# Altium schematic sheet 3V3_PCM.SchDoc
size A4
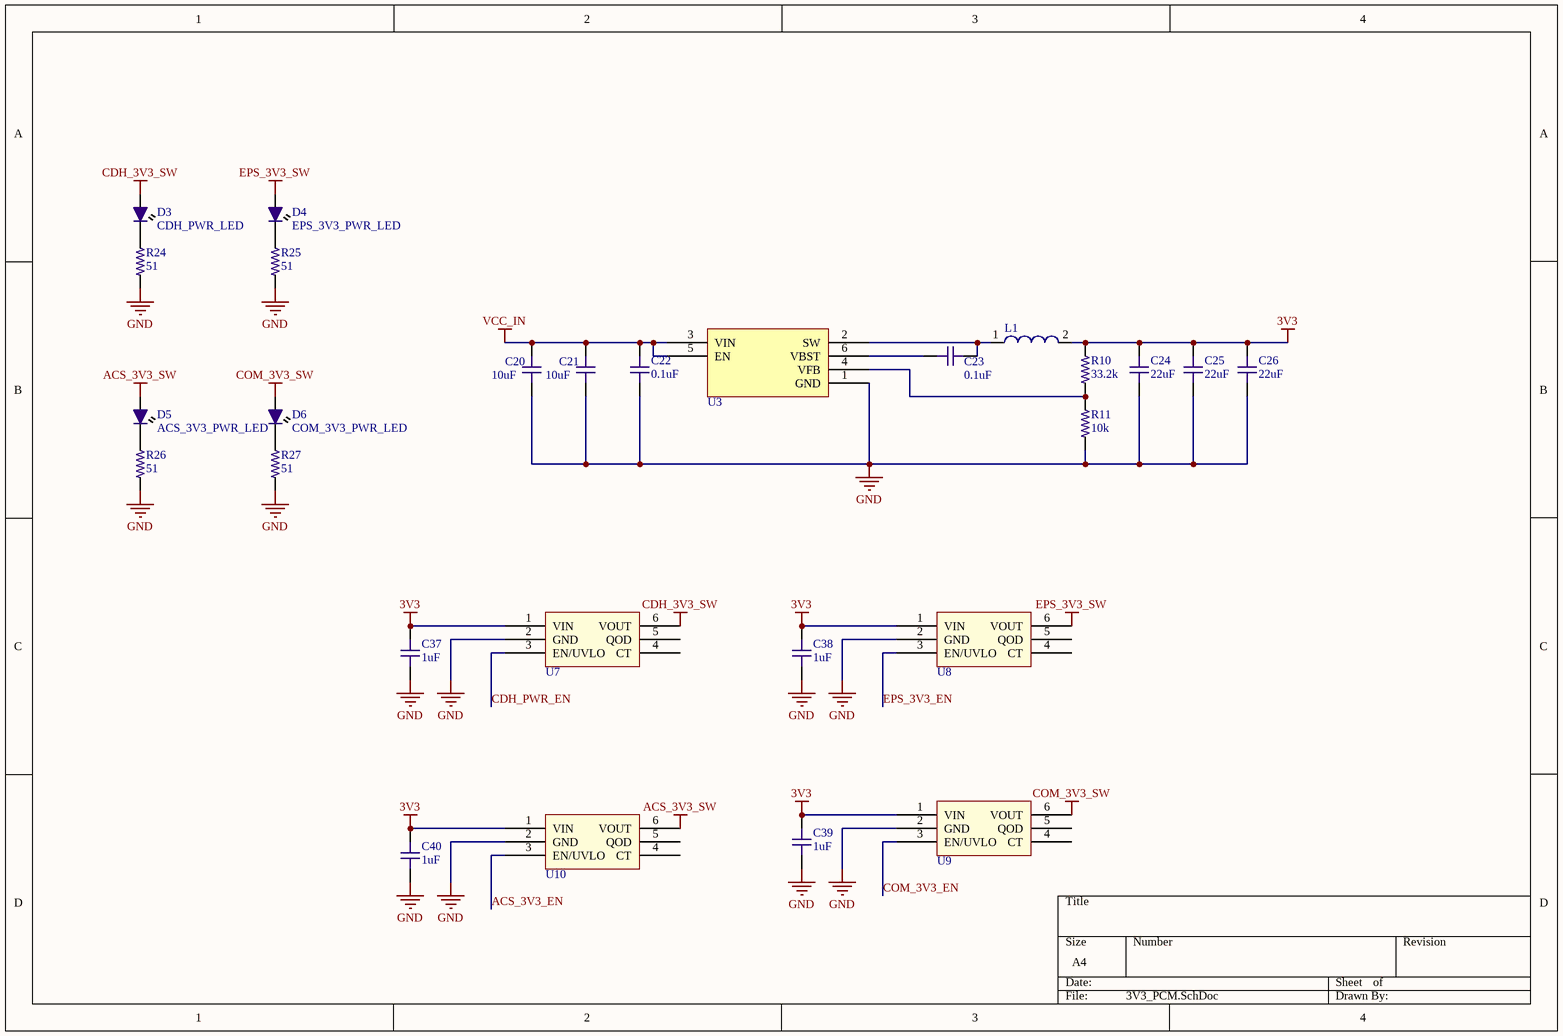
[diagram p0: 3V3_PCM.SchDoc]

## Parts
C20  value 10uF  [C1206-IPC]  (hidden comment: Cin)
C21  value 10uF  [C1206-IPC]  (hidden comment: Cin)
C22  value 0.1uF  [C0603-IPC]  (hidden comment: Cinx)
C23  value 0.1uF  [C0603-IPC]  (hidden comment: Cbst)
C24  value 22uF  [C0603-IPC]  (hidden comment: Cout)
C25  value 22uF  [C0603-IPC]  (hidden comment: Cout)
C26  value 22uF  [C0603-IPC]  (hidden comment: Cout)
C37  value 1uF  [C0603-IPC]  (hidden comment: Capacitor)
C38  value 1uF  [C0603-IPC]  (hidden comment: Capacitor)
C39  value 1uF  [C0603-IPC]  (hidden comment: Capacitor)
C40  value 1uF  [C0603-IPC]  (hidden comment: Capacitor)
D3  CDH_PWR_LED  [LED0603-IPC]
D4  EPS_3V3_PWR_LED  [LED0603-IPC]
D5  ACS_3V3_PWR_LED  [LED0603-IPC]
D6  COM_3V3_PWR_LED  [LED0603-IPC]
L1  74437349022  [WE-LHMI 7050]  (value not drawn)
R10  value 33.2k  [R0402-IPC]  (hidden comment: Rfbt)
R11  value 10k  [R0402-IPC]  (hidden comment: Rfbb)
R24  value 51  [R0603-IPC]  (hidden comment: 0603 Template)
R25  value 51  [R0603-IPC]  (hidden comment: 0603 Template)
R26  value 51  [R0603-IPC]  (hidden comment: 0603 Template)
R27  value 51  [R0603-IPC]  (hidden comment: 0603 Template)
U3  Buck  [SOT23-6_L]  (value not drawn)
U7  One Channel Load Switch  [TPS22810-Q1]  (value not drawn)
U8  One Channel Load Switch  [TPS22810-Q1]  (value not drawn)
U9  One Channel Load Switch  [TPS22810-Q1]  (value not drawn)
U10  One Channel Load Switch  [TPS22810-Q1]  (value not drawn)

## Nets
3V3: C24.2 C25.2 C26.2 C37.2 C38.2 C39.2 C40.2 L1.2 R10.2 U7.1(VIN) U8.1(VIN) U9.1(VIN) U10.1(VIN)
ACS_3V3_SW: D5.A U10.6(VOUT)
CDH_3V3_SW: D3.A U7.6(VOUT)
COM_3V3_SW: D6.A U9.6(VOUT)
EPS_3V3_SW: D4.A U8.6(VOUT)
GND: C20.1 C21.1 C22.1 C24.1 C25.1 C26.1 C37.1 C38.1 C39.1 C40.1 R11.1 R24.2 R25.2 R26.2 R27.2 U3.1(GND) U7.2(GND) U8.2(GND) U9.2(GND) U10.2(GND)
VCC_IN: C20.2 C21.2 C22.2 U3.3(VIN) U3.5(EN)
ACS_3V3_EN: U10.3(EN/UVLO)
CDH_PWR_EN: U7.3(EN/UVLO)
COM_3V3_EN: U9.3(EN/UVLO)
EPS_3V3_EN: U8.3(EN/UVLO)
NetC23_1: C23.1 U3.6(VBST)
NetC23_2: C23.2 L1.1 U3.2(SW)
NetD3_K: D3.K R24.1
NetD4_K: D4.K R25.1
NetD5_K: D5.K R26.1
NetD6_K: D6.K R27.1
NetR10_1: R10.1 R11.2 U3.4(VFB)

Not connected (* = marked no-connect by the designer): U7 4(CT) 5(QOD); U8 4(CT) 5(QOD); U9 4(CT) 5(QOD); U10 4(CT) 5(QOD)

## Library data of the parts
C20 C21 = 15: Capacitor (1206) 10uF 25V X5R 1206; OrbitPartId: 15; Type: Passive; EIA Code: X5R; Max. Voltage: 25V; PartId: 1; Subtype: Capacitor; ComponentLink1Description: 12063D106KAT2A; ComponentLink1URL: https://www.digikey.ca/en/products/detail/avx-corporation/12063D106KAT2A/1950914
C22 C23 = 13: Cap Cer 0.1uF 10% 25V Cer Cap X7R 0603; OrbitPartId: 13; Type: Passive; EIA Code: X7R; Max. Voltage: 25V; PartId: 1; Subtype: Capacitor; ComponentLink1Description: C0603C104K3RACTU; ComponentLink1URL: https://www.digikey.ca/en/products/detail/kemet/C0603C104K3RACTU/416044?s=N4IgTCBcDaIMIAYBsCDMcCMCAsBpVASgIJwAqAqiALoC%2BQA
C24-C26 = 13: Cap Cer 22uF 10V X5R 0603; OrbitPartId: 13; Type: Passive; EIA Code: X5R; Max. Voltage: 10V; PartId: 1; Subtype: Capacitor; ComponentLink1Description: C1608X5R1A226M080AC; ComponentLink1URL: https://www.digikey.ca/en/products/detail/tdk-corporation/C1608X5R1A226M080AC/3661560?s=N4IgTCBcDaIMIEYBsAGAHADQKwCUEEEwwkBZdFfOEAXQF8g
C37-C40 = 13: Capacitor (0603); OrbitPartId: 13; EIA Code: X5R; Max. Voltage: 16V; Type: Passive; PartId: 1; Subtype: Capacitor
D3-D6 = LED 0603 SMD: Red PWR_LED; Supplier 1: Digi-Key; Supplier Part Number 1: 732-4966-1-ND
L1 = CMP-1353-00064-1: SMD Power Inductor WE-LHMI, L=2.2 µH; Manufacturer: Wuerth Elektronik; Inductance: 2.2 ÂµH; ComponentLink1Description: Manufacturer URL; ComponentLink2Description: Datasheet; PartNumber: 74437349022; ComponentLink2URL: http://katalog.we-online.de/kataloge/eisos/media/pdf/74437349022.pdf; ComponentLink1URL: http://www.we-online.com; PackageReference: WE-LHMI 7050
R10 = 19: 33.2k 1% 0402; OrbitPartId: 19; PartId: 1; Type: Passive; Subtype: Resistor; ComponentLink1Description: CRCW040233K2FKED; ComponentLink1URL: https://www.digikey.ca/en/products/detail/vishay-dale/CRCW040233K2FKED/1178179
R11 = 19: 10k 1% 0402; OrbitPartId: 19; PartId: 1; Type: Passive; Subtype: Resistor; ComponentLink1Description: CRCW040210K0FKED; ComponentLink1URL: https://www.digikey.ca/en/products/detail/vishay-dale/CRCW040210K0FKED/1178121
R24-R27 = 0603 Template: Chip Resistor, 0603, 51hms, 0.1W
U3 = TPS565208DDC: 4.5V tp 17V, 5A Synchronous Step-Down Voltage Regulator; ComponentLink1Description: Datasheet; ComponentLink1URL: http://www.ti.com/lit/ds/symlink/tps565208.pdf
U7-U10 = TPS22810-Q1: 2.7 - 18V @ 2A Max